# EAGLE design tach_adapter (EAGLE 7.7.0)
Assembly variants: Rev A Final
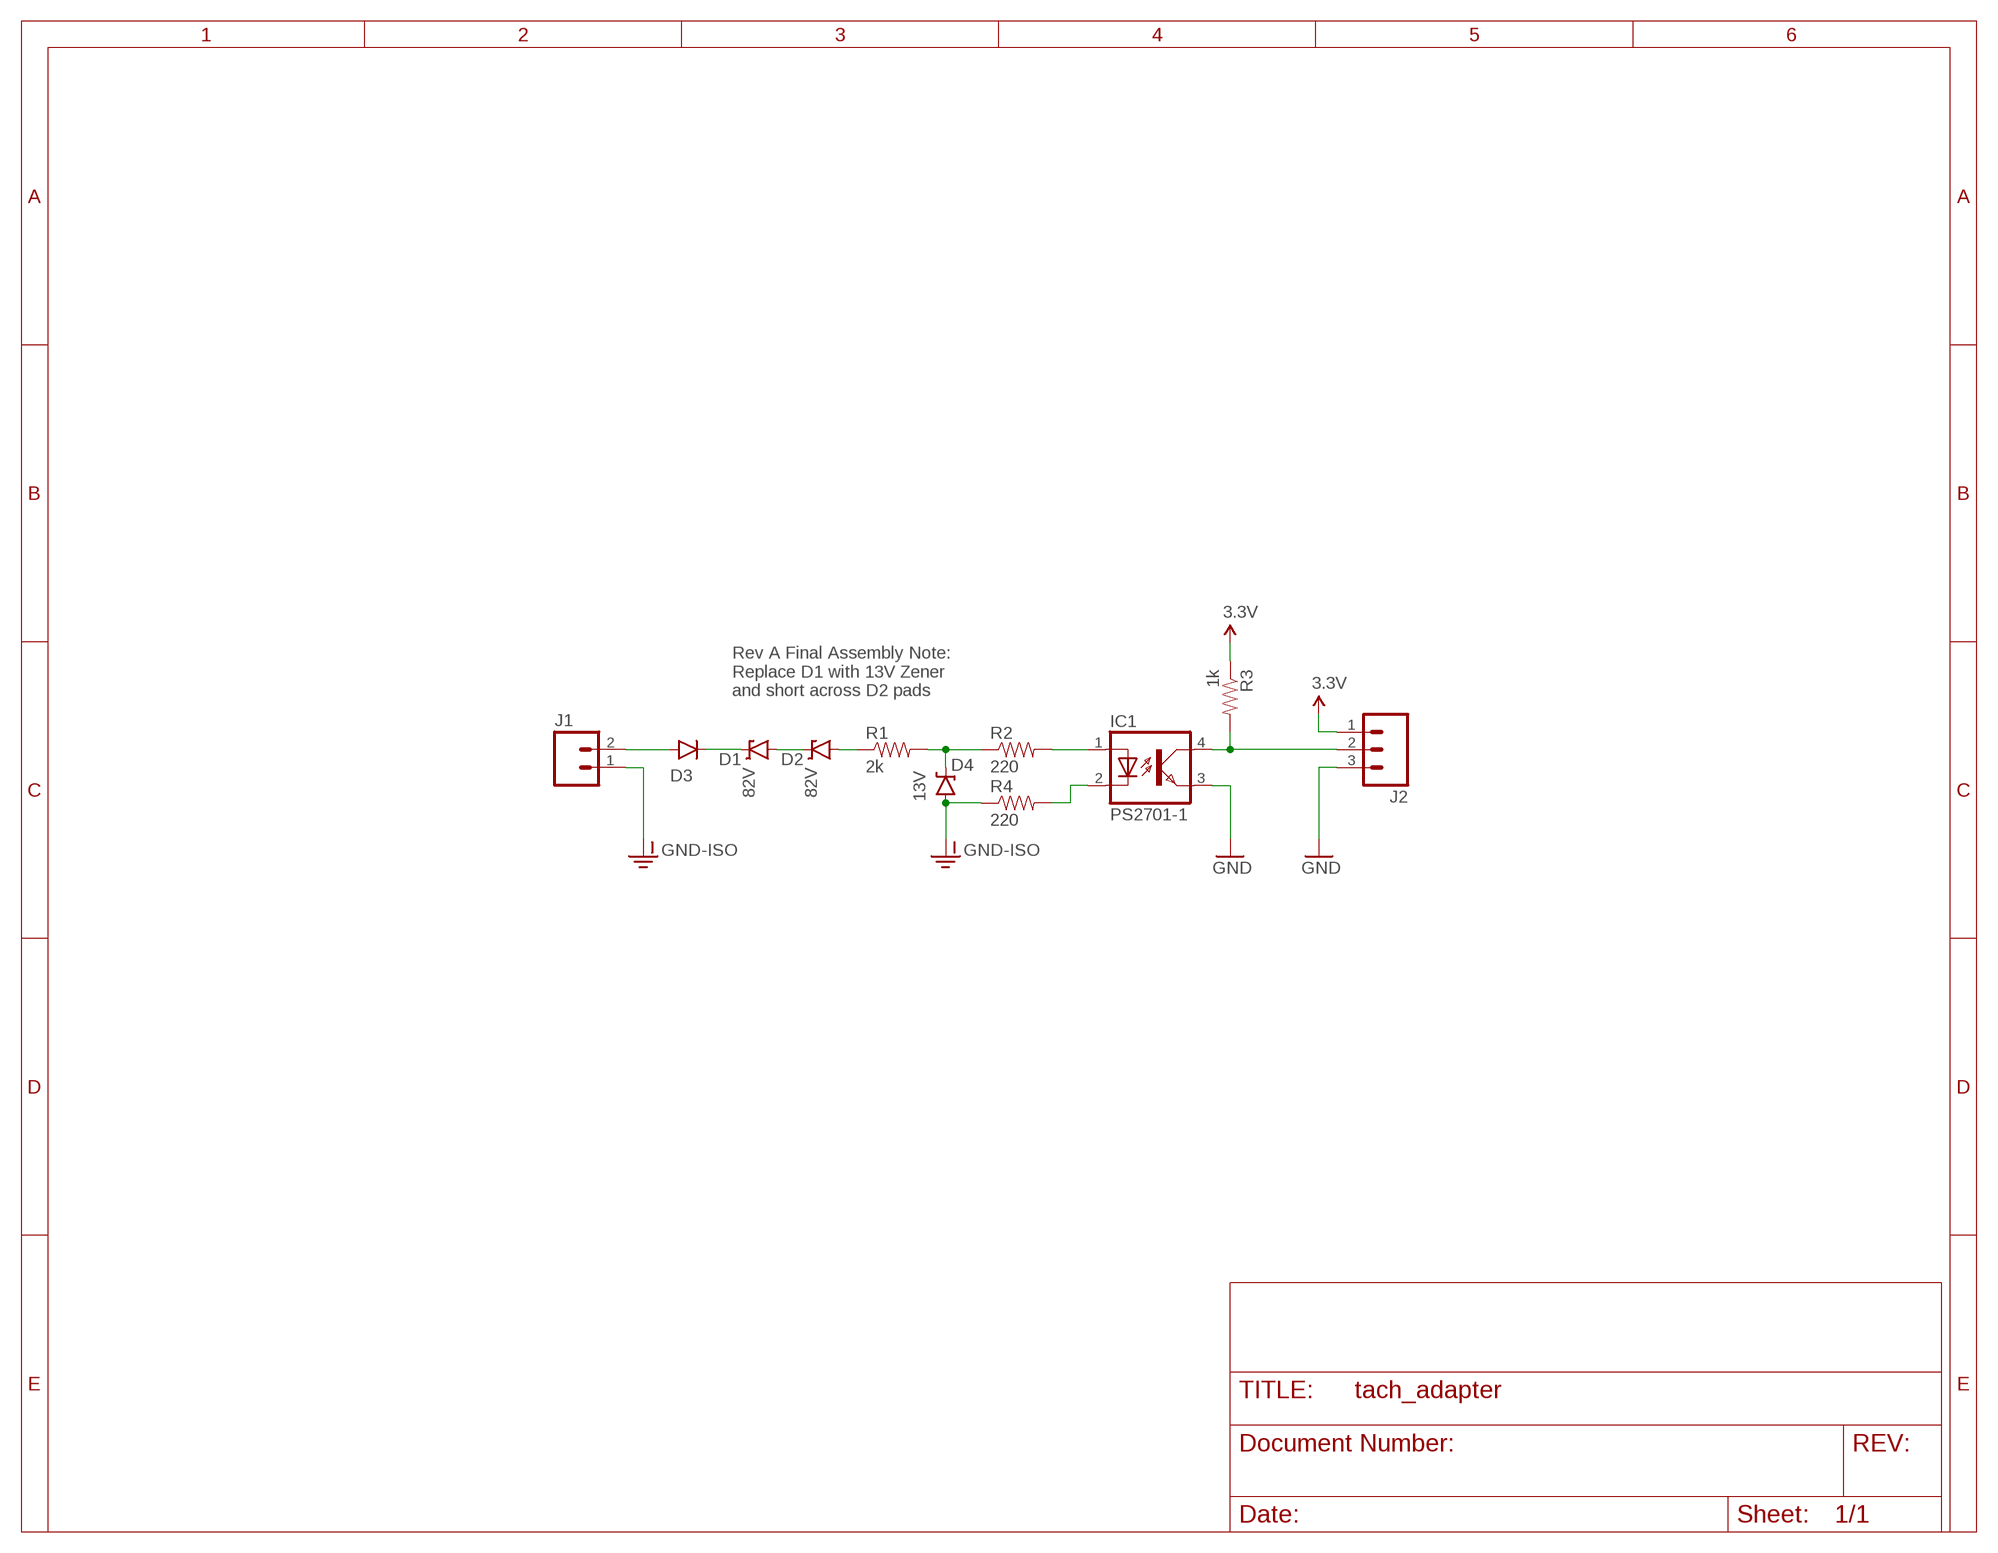
[diagram p0: schematic, sheet 1]

## Parts
D1  82V  DIODE-ZENERSMB  [SMB-DIODE]
D2  82V  DIODE-ZENERSMB  [SMB-DIODE]  (not fitted in variant Rev A Final)
D3  DIODESMA  [SMA-DIODE]
D4  13V  DIODE-ZENERSMB  [SMB-DIODE]  (not fitted in variant Rev A Final)
IC1  PS2701-1  [4-SMD]
J1  M02PTH3  [1X02_LONGPADS]
J2  M03LONGPADS  [1X03_LONGPADS]
R1  2k  RESISTOR1206  [1206]
R2  220  RESISTOR1206  [1206]
R3  1k  RESISTOR1206  [1206]
R4  220  RESISTOR1206  [1206]

## Nets
3.3V: J2.1 R3.1
GND: IC1.3(EMIT) J2.3
GND-ISO: D4.A J1.1 R4.1
N$1: D1.C D3.C
N$2: D1.A D2.C
N$3: D2.A R1.1
N$4: D4.C R1.2 R2.1
N$5: IC1.1(A) R2.2
N$6: IC1.2(C) R4.2
N$7: IC1.4(COL) J2.2 R3.2
N$8: D3.A J1.2

## Notes on the sheet
- Rev A Final Assembly Note:
  Replace D1 with 13V Zener 
  and short across D2 pads

## Library data of the parts
D1 D2 D4 = SparkFun-DiscreteSemi:DIODE-ZENER: Zener Diode Production Part - 8199 3.4V Zener Voltage
D3 = SparkFun-DiscreteSemi:DIODE: Diode These are standard reverse protection diodes and small signal diodes. SMA package can handle up to about 1A. SOD-323 can handle about 200mA. What the SOD-323 package when ordering, there are some mfgs out there that are 5-pin packages.
IC1 = tach_adapter:PS2701-1
J1 = SparkFun-Connectors:M02: Standard 2-pin 0.1" header. Use with - straight break away headers ( PRT-00116) - right angle break away headers (PRT-00553) - swiss pins (PRT-00743) - machine pins (PRT-00117) - female headers (PRT-00115) Molex polarized connector foot print use with: PRT-08233 with associated crimp pins and housings. 2.54_SCREWTERM for use with PRT-10571. 3.5mm Screw Terminal footprints for PRT-08084 5mm Screw Terminal footprints for use with PRT-08432
J2 = SparkFun-Connectors:M03: Header 3 Standard 3-pin 0.1" header. Use with straight break away headers (SKU : PRT-00116), right angle break away headers (PRT-00553), swiss pins (PRT-00743), machine pins (PRT-00117), and female headers (PRT-00115). Molex polarized connector foot print use with SKU : PRT-08232 with associated crimp pins and housings.
R1-R4 = SparkFun-Passives:RESISTOR: Resistor Basic schematic elements and footprints for 0603, 1206, and PTH resistors.

## Board
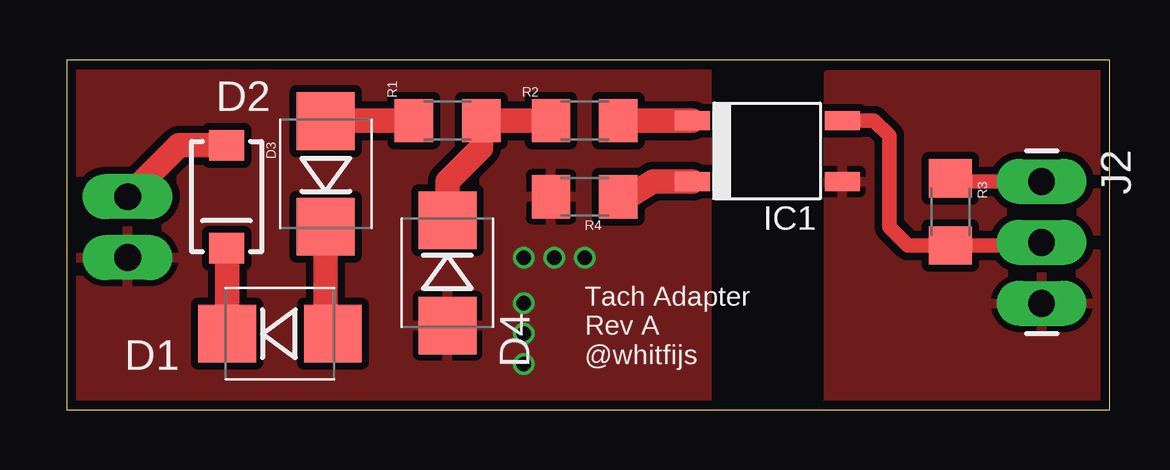
[diagram p1: board, top side]
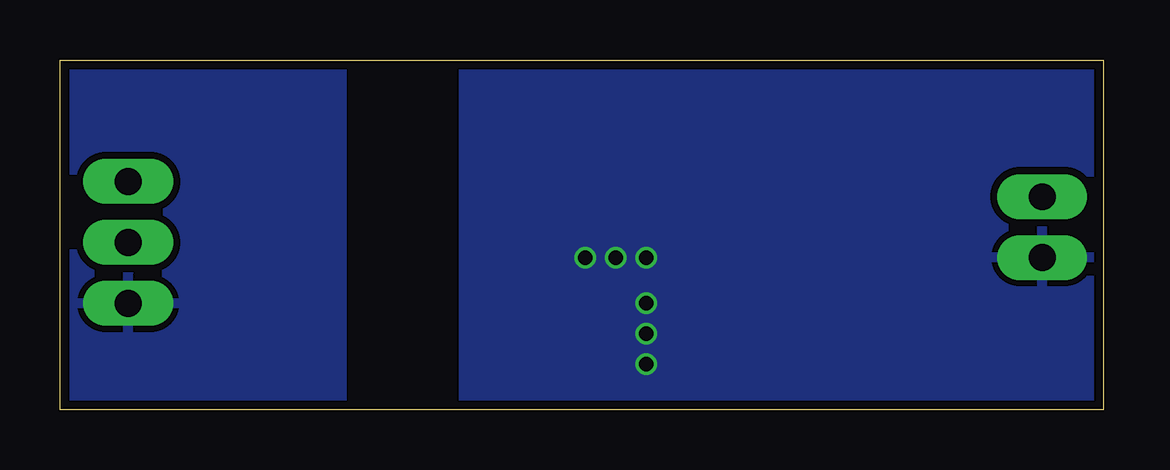
[diagram p2: board, bottom side, seen from below]

Size 43.48 x 14.59 mm. Coordinates in mm from the lower left corner, seen from the top.
Outline: 0,0 43.48,0 43.48,14.59 0,14.59 0,0
Copper layers (1*16): Top 0.035559375mm / dielectric 1.6mm / Bottom 0.035559375mm
Design rules "oshpark-2layer": minimum track width 6mil, minimum drill 10mil, track to track 6mil, track to pad 6mil, pad to pad 6mil, via to via 6mil, smd to smd 6mil, copper to edge 15mil, drill to drill 6mil, minimum pad ring 5mil, minimum via ring 5mil, stop-mask expansion 2.5mil, vias tented up to drill 0mil, thermal gap 10mil

### Footprints (pad centres in the part's own frame; a part is rotated, then mirrored left to right if it is on the bottom)
SMB-DIODE = smd 2.4 x 2.4: A 2.2,0; C -2.2,0
SMA-DIODE = smd 1.27 x 1.47: A -2.15,0; C 2.15,0
4-SMD = smd 1.45 x 0.8: 1 -3.125,1.27; 2 -3.125,-1.27; 3 3.125,-1.27; 4 3.125,1.27
1X02_LONGPADS = drill 1.118 pad 1.88 long: 1 0,0; 2 2.54,0
1X03_LONGPADS = drill 1.118 pad 1.88 long: 1 0,0; 2 2.54,0; 3 5.08,0
1206 = smd 1.6 x 1.8: 1 -1.4,0; 2 1.4,0

### Placement (x,y rotation side)
D1  8.89,3.17 0 top
D2  10.79,9.84 90 top  (not fitted)
D3  6.67,8.89 270 top
D4  15.88,5.71 270 top  (not fitted)
IC1  29.21,10.79 0 top
J1  2.54,6.35 90 top
J2  40.64,9.53 270 top
R1  15.88,12.06 0 top
R2  21.59,12.06 0 top
R3  36.83,8.26 270 top
R4  21.59,8.89 0 top

### Tracks (layer width: path | path; a pad name or v marks a point on that pad's centre or on a via)
3.3V
  Top 0.61: R3.1 36.96,9.53 J2.1
GND
  pour Top (isolate 0.305): 31.75,13.97 31.75,0 43.81,0 43.81,13.97
  pour Bottom (isolate 0.305): 31.75,14.61 31.75,0 43.81,0 43.81,14.61
GND-ISO  (via drill 0.6)
  other vias: 19.05,6.35 20.32,6.35 21.59,6.35 19.05,4.45 19.05,3.17 19.05,1.91
  pour Top (isolate 0.305): 0,14.61 26.67,14.61 26.67,0 0,0
  pour Bottom (isolate 0.305): 0,14.61 26.67,14.61 26.67,0 0,0
N$1
  Top 1.016: D3.C 6.69,6.4 D1.C
N$2
  Top 1.016: D1.A 10.79,3.47 D2.C
N$3
  Top 1.016: D2.A 10.95,12.2 11.08,12.06 R1.1
N$4
  Top 1.016: R2.1 R1.2 17.27,10.92 15.88,9.53 D4.C
N$5
  Top 1.016: R2.2 IC1.1
N$6
  Top 1.016: IC1.2 24.45,9.53 23.62,9.02 R4.2
N$7
  Top 0.61: IC1.4 33.66,12.06 34.29,11.43 34.29,7.62 35.05,6.86 R3.2 40.51,6.86 J2.2
N$8
  Top 1.016: J1.2 4.69,11.04 D3.A

### Text on the board
tNames: Tach Adapter / Rev A / @whitfijs